# EAGLE schematic board (EAGLE 9.6.2)
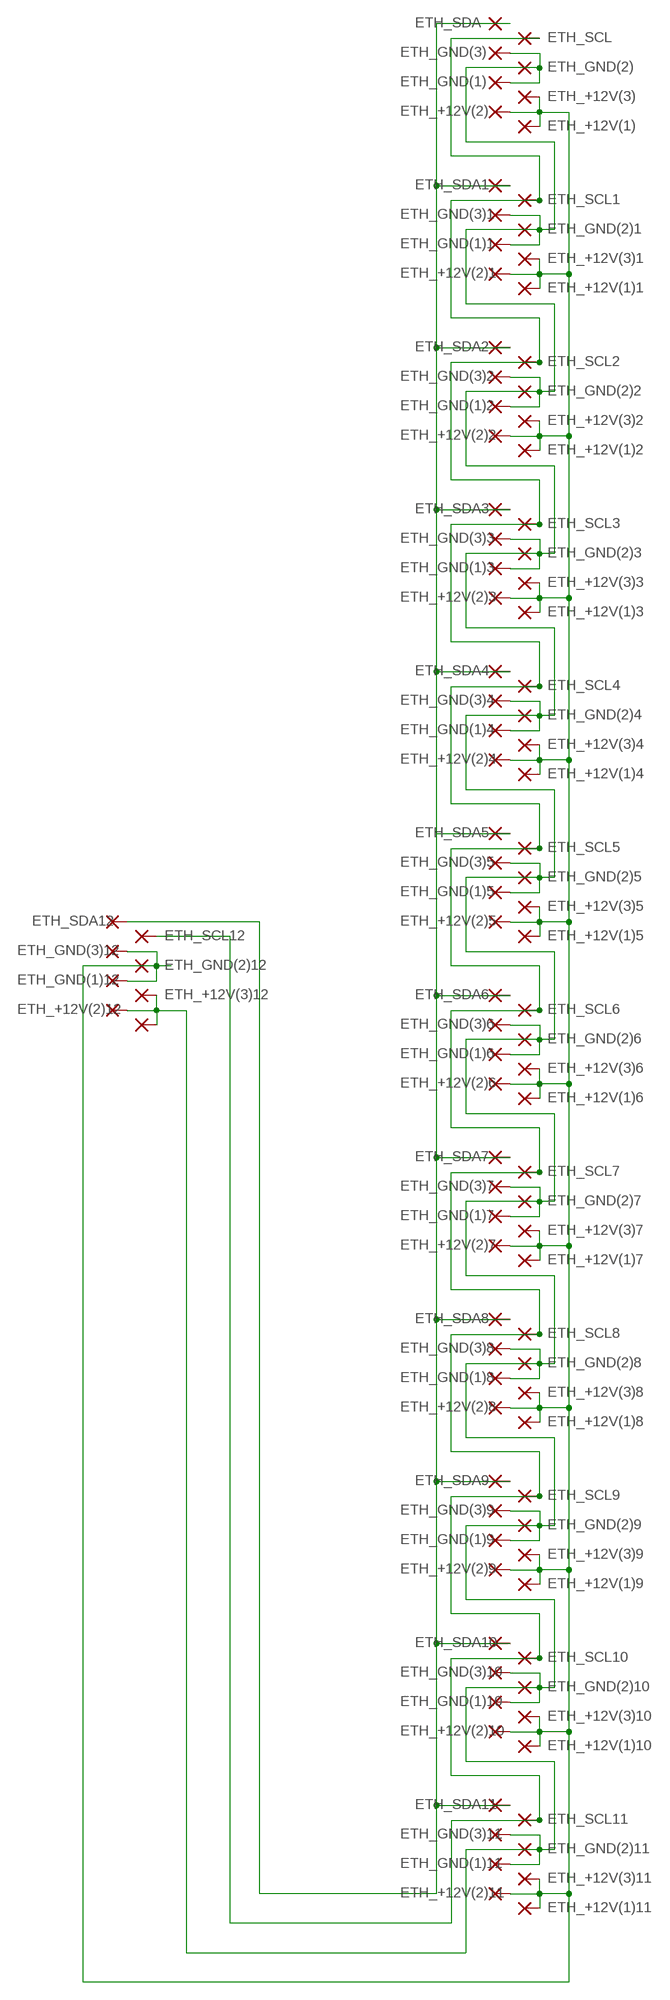
[diagram p0: schematic, sheet 1]

## Parts
ETH_+12V(1)  2,15/1,0  [2,15/1,0]
ETH_+12V(1)1  2,15/1,0  [2,15/1,0]
ETH_+12V(1)2  2,15/1,0  [2,15/1,0]
ETH_+12V(1)3  2,15/1,0  [2,15/1,0]
ETH_+12V(1)4  2,15/1,0  [2,15/1,0]
ETH_+12V(1)5  2,15/1,0  [2,15/1,0]
ETH_+12V(1)6  2,15/1,0  [2,15/1,0]
ETH_+12V(1)7  2,15/1,0  [2,15/1,0]
ETH_+12V(1)8  2,15/1,0  [2,15/1,0]
ETH_+12V(1)9  2,15/1,0  [2,15/1,0]
ETH_+12V(1)10  2,15/1,0  [2,15/1,0]
ETH_+12V(1)11  2,15/1,0  [2,15/1,0]
ETH_+12V(1)12  2,15/1,0  [2,15/1,0]
ETH_+12V(2)  2,15/1,0  [2,15/1,0]
ETH_+12V(2)1  2,15/1,0  [2,15/1,0]
ETH_+12V(2)2  2,15/1,0  [2,15/1,0]
ETH_+12V(2)3  2,15/1,0  [2,15/1,0]
ETH_+12V(2)4  2,15/1,0  [2,15/1,0]
ETH_+12V(2)5  2,15/1,0  [2,15/1,0]
ETH_+12V(2)6  2,15/1,0  [2,15/1,0]
ETH_+12V(2)7  2,15/1,0  [2,15/1,0]
ETH_+12V(2)8  2,15/1,0  [2,15/1,0]
ETH_+12V(2)9  2,15/1,0  [2,15/1,0]
ETH_+12V(2)10  2,15/1,0  [2,15/1,0]
ETH_+12V(2)11  2,15/1,0  [2,15/1,0]
ETH_+12V(2)12  2,15/1,0  [2,15/1,0]
ETH_+12V(3)  2,15/1,0  [2,15/1,0]
ETH_+12V(3)1  2,15/1,0  [2,15/1,0]
ETH_+12V(3)2  2,15/1,0  [2,15/1,0]
ETH_+12V(3)3  2,15/1,0  [2,15/1,0]
ETH_+12V(3)4  2,15/1,0  [2,15/1,0]
ETH_+12V(3)5  2,15/1,0  [2,15/1,0]
ETH_+12V(3)6  2,15/1,0  [2,15/1,0]
ETH_+12V(3)7  2,15/1,0  [2,15/1,0]
ETH_+12V(3)8  2,15/1,0  [2,15/1,0]
ETH_+12V(3)9  2,15/1,0  [2,15/1,0]
ETH_+12V(3)10  2,15/1,0  [2,15/1,0]
ETH_+12V(3)11  2,15/1,0  [2,15/1,0]
ETH_+12V(3)12  2,15/1,0  [2,15/1,0]
ETH_GND(1)  2,15/1,0  [2,15/1,0]
ETH_GND(1)1  2,15/1,0  [2,15/1,0]
ETH_GND(1)2  2,15/1,0  [2,15/1,0]
ETH_GND(1)3  2,15/1,0  [2,15/1,0]
ETH_GND(1)4  2,15/1,0  [2,15/1,0]
ETH_GND(1)5  2,15/1,0  [2,15/1,0]
ETH_GND(1)6  2,15/1,0  [2,15/1,0]
ETH_GND(1)7  2,15/1,0  [2,15/1,0]
ETH_GND(1)8  2,15/1,0  [2,15/1,0]
ETH_GND(1)9  2,15/1,0  [2,15/1,0]
ETH_GND(1)10  2,15/1,0  [2,15/1,0]
ETH_GND(1)11  2,15/1,0  [2,15/1,0]
ETH_GND(1)12  2,15/1,0  [2,15/1,0]
ETH_GND(2)  2,15/1,0  [2,15/1,0]
ETH_GND(2)1  2,15/1,0  [2,15/1,0]
ETH_GND(2)2  2,15/1,0  [2,15/1,0]
ETH_GND(2)3  2,15/1,0  [2,15/1,0]
ETH_GND(2)4  2,15/1,0  [2,15/1,0]
ETH_GND(2)5  2,15/1,0  [2,15/1,0]
ETH_GND(2)6  2,15/1,0  [2,15/1,0]
ETH_GND(2)7  2,15/1,0  [2,15/1,0]
ETH_GND(2)8  2,15/1,0  [2,15/1,0]
ETH_GND(2)9  2,15/1,0  [2,15/1,0]
ETH_GND(2)10  2,15/1,0  [2,15/1,0]
ETH_GND(2)11  2,15/1,0  [2,15/1,0]
ETH_GND(2)12  2,15/1,0  [2,15/1,0]
ETH_GND(3)  2,15/1,0  [2,15/1,0]
ETH_GND(3)1  2,15/1,0  [2,15/1,0]
ETH_GND(3)2  2,15/1,0  [2,15/1,0]
ETH_GND(3)3  2,15/1,0  [2,15/1,0]
ETH_GND(3)4  2,15/1,0  [2,15/1,0]
ETH_GND(3)5  2,15/1,0  [2,15/1,0]
ETH_GND(3)6  2,15/1,0  [2,15/1,0]
ETH_GND(3)7  2,15/1,0  [2,15/1,0]
ETH_GND(3)8  2,15/1,0  [2,15/1,0]
ETH_GND(3)9  2,15/1,0  [2,15/1,0]
ETH_GND(3)10  2,15/1,0  [2,15/1,0]
ETH_GND(3)11  2,15/1,0  [2,15/1,0]
ETH_GND(3)12  2,15/1,0  [2,15/1,0]
ETH_SCL  2,15/1,0  [2,15/1,0]
ETH_SCL1  2,15/1,0  [2,15/1,0]
ETH_SCL2  2,15/1,0  [2,15/1,0]
ETH_SCL3  2,15/1,0  [2,15/1,0]
ETH_SCL4  2,15/1,0  [2,15/1,0]
ETH_SCL5  2,15/1,0  [2,15/1,0]
ETH_SCL6  2,15/1,0  [2,15/1,0]
ETH_SCL7  2,15/1,0  [2,15/1,0]
ETH_SCL8  2,15/1,0  [2,15/1,0]
ETH_SCL9  2,15/1,0  [2,15/1,0]
ETH_SCL10  2,15/1,0  [2,15/1,0]
ETH_SCL11  2,15/1,0  [2,15/1,0]
ETH_SCL12  2,15/1,0  [2,15/1,0]
ETH_SDA  2,15/1,0  [2,15/1,0]
ETH_SDA1  2,15/1,0  [2,15/1,0]
ETH_SDA2  2,15/1,0  [2,15/1,0]
ETH_SDA3  2,15/1,0  [2,15/1,0]
ETH_SDA4  2,15/1,0  [2,15/1,0]
ETH_SDA5  2,15/1,0  [2,15/1,0]
ETH_SDA6  2,15/1,0  [2,15/1,0]
ETH_SDA7  2,15/1,0  [2,15/1,0]
ETH_SDA8  2,15/1,0  [2,15/1,0]
ETH_SDA9  2,15/1,0  [2,15/1,0]
ETH_SDA10  2,15/1,0  [2,15/1,0]
ETH_SDA11  2,15/1,0  [2,15/1,0]
ETH_SDA12  2,15/1,0  [2,15/1,0]

## Nets
N$6: ETH_+12V(1)1.1(P) ETH_+12V(1)2.1(P) ETH_+12V(1)3.1(P) ETH_+12V(1)4.1(P) ETH_+12V(1)5.1(P) ETH_+12V(1)6.1(P) ETH_+12V(1)7.1(P) ETH_+12V(1)8.1(P) ETH_+12V(1)9.1(P) ETH_+12V(1)10.1(P) ETH_+12V(1)11.1(P) ETH_+12V(1).1(P) ETH_+12V(2)1.1(P) ETH_+12V(2)2.1(P) ETH_+12V(2)3.1(P) ETH_+12V(2)4.1(P) ETH_+12V(2)5.1(P) ETH_+12V(2)6.1(P) ETH_+12V(2)7.1(P) ETH_+12V(2)8.1(P) ETH_+12V(2)9.1(P) ETH_+12V(2)10.1(P) ETH_+12V(2)11.1(P) ETH_+12V(2).1(P) ETH_+12V(3)1.1(P) ETH_+12V(3)2.1(P) ETH_+12V(3)3.1(P) ETH_+12V(3)4.1(P) ETH_+12V(3)5.1(P) ETH_+12V(3)6.1(P) ETH_+12V(3)7.1(P) ETH_+12V(3)8.1(P) ETH_+12V(3)9.1(P) ETH_+12V(3)10.1(P) ETH_+12V(3)11.1(P) ETH_+12V(3).1(P) ETH_GND(1)12.1(P) ETH_GND(2)12.1(P) ETH_GND(3)12.1(P)
N$17: ETH_SDA1.1(P) ETH_SDA2.1(P) ETH_SDA3.1(P) ETH_SDA4.1(P) ETH_SDA5.1(P) ETH_SDA6.1(P) ETH_SDA7.1(P) ETH_SDA8.1(P) ETH_SDA9.1(P) ETH_SDA10.1(P) ETH_SDA11.1(P) ETH_SDA12.1(P) ETH_SDA.1(P)
N$37: ETH_SCL1.1(P) ETH_SCL2.1(P) ETH_SCL3.1(P) ETH_SCL4.1(P) ETH_SCL5.1(P) ETH_SCL6.1(P) ETH_SCL7.1(P) ETH_SCL8.1(P) ETH_SCL9.1(P) ETH_SCL10.1(P) ETH_SCL11.1(P) ETH_SCL12.1(P) ETH_SCL.1(P)
N$42: ETH_+12V(1)12.1(P) ETH_+12V(2)12.1(P) ETH_+12V(3)12.1(P) ETH_GND(1)1.1(P) ETH_GND(1)2.1(P) ETH_GND(1)3.1(P) ETH_GND(1)4.1(P) ETH_GND(1)5.1(P) ETH_GND(1)6.1(P) ETH_GND(1)7.1(P) ETH_GND(1)8.1(P) ETH_GND(1)9.1(P) ETH_GND(1)10.1(P) ETH_GND(1)11.1(P) ETH_GND(1).1(P) ETH_GND(2)1.1(P) ETH_GND(2)2.1(P) ETH_GND(2)3.1(P) ETH_GND(2)4.1(P) ETH_GND(2)5.1(P) ETH_GND(2)6.1(P) ETH_GND(2)7.1(P) ETH_GND(2)8.1(P) ETH_GND(2)9.1(P) ETH_GND(2)10.1(P) ETH_GND(2)11.1(P) ETH_GND(2).1(P) ETH_GND(3)1.1(P) ETH_GND(3)2.1(P) ETH_GND(3)3.1(P) ETH_GND(3)4.1(P) ETH_GND(3)5.1(P) ETH_GND(3)6.1(P) ETH_GND(3)7.1(P) ETH_GND(3)8.1(P) ETH_GND(3)9.1(P) ETH_GND(3)10.1(P) ETH_GND(3)11.1(P) ETH_GND(3).1(P)

## Library data of the parts
ETH_+12V(1) ETH_+12V(1)1-ETH_+12V(1)12 ETH_+12V(2) ETH_+12V(2)1-ETH_+12V(2)12 ETH_+12V(3) ETH_+12V(3)1-ETH_+12V(3)12 ETH_GND(1) ETH_GND(1)1-ETH_GND(1)12 ETH_GND(2) ETH_GND(2)1-ETH_GND(2)12 ETH_GND(3) ETH_GND(3)1-ETH_GND(3)12 ETH_SCL ETH_SCL1-ETH_SCL12 ETH_SDA ETH_SDA1-ETH_SDA12 = wirepad:2,15/1,0: THROUGH-HOLE PAD